# Altium schematic sheet PIC32MK.SchDoc
size A4; SheetNumber: 9; SheetTotal: 13
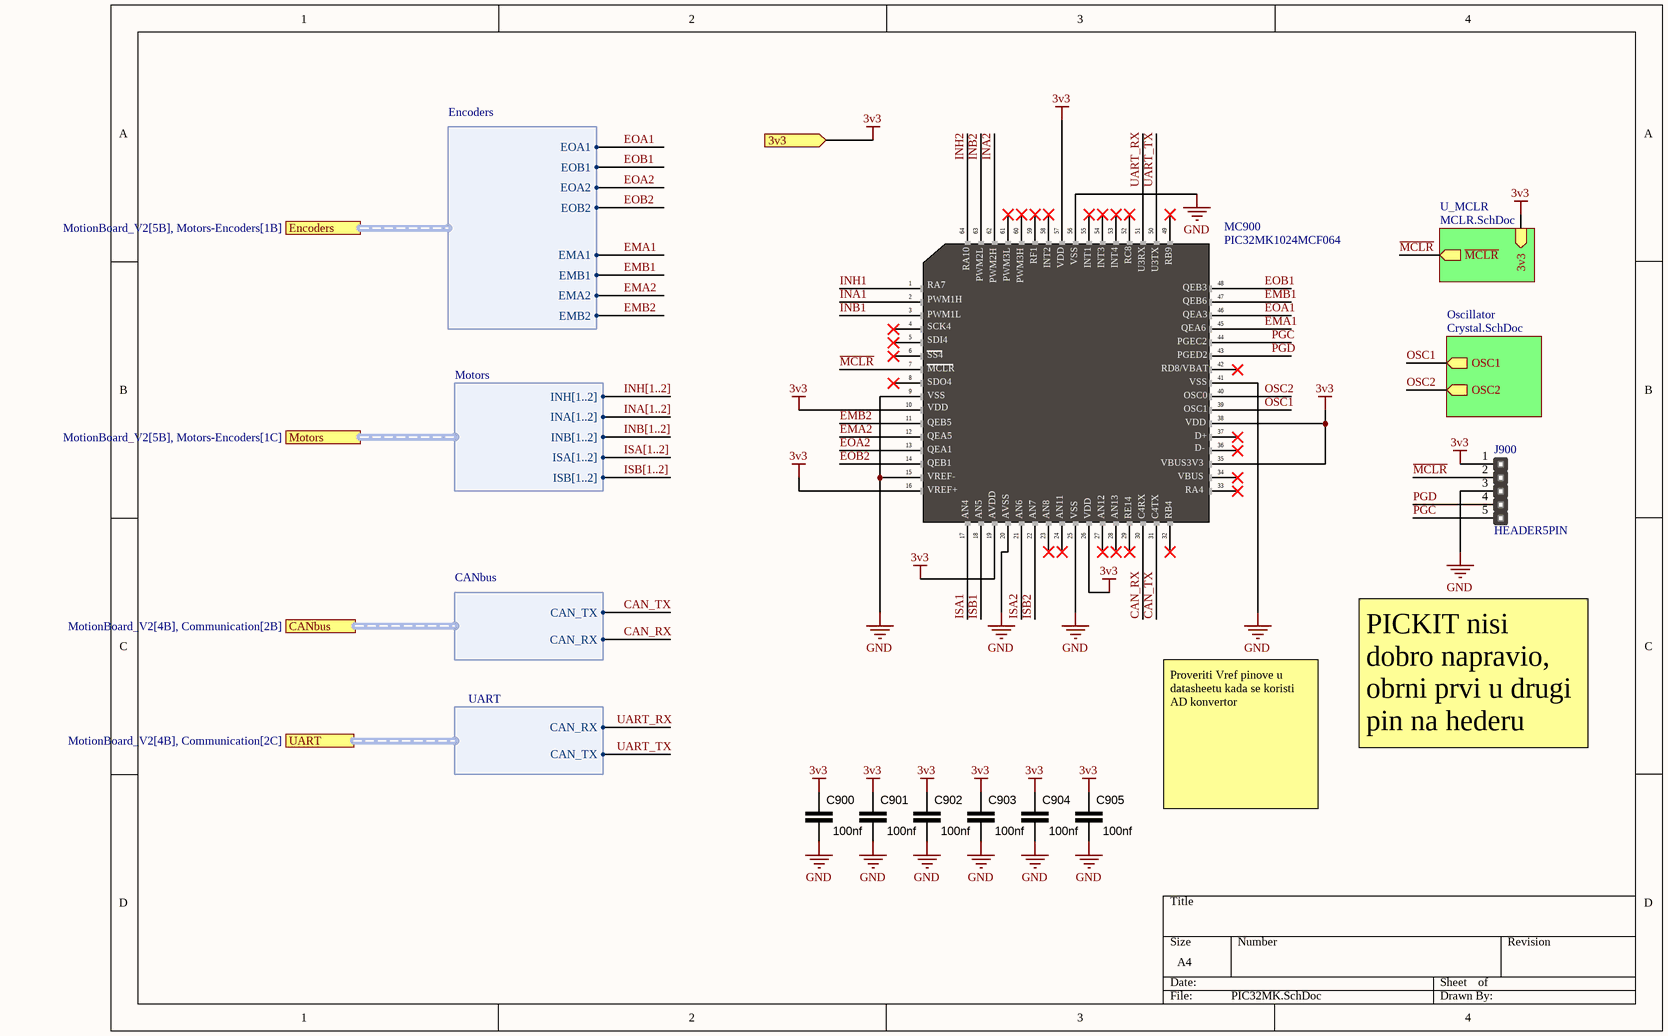
[diagram p0: PIC32MK.SchDoc]

## Parts
C900  100nf  [CAP_0603]
C901  100nf  [CAP_0603]
C902  100nf  [CAP_0603]
C903  100nf  [CAP_0603]
C904  100nf  [CAP_0603]
C905  100nf  [CAP_0603]
J900  HEADER5PIN  [HEADER5PIN]
MC900  PIC32MK1024MCF064  [PIC32MK_64-TQFP]

## Sub-sheets
Oscillator = Crystal.SchDoc: OSC1 (out), OSC2 (out)
U_MCLR = MCLR.SchDoc: ~{MCLR} (out), 3v3 (in)

## Ports
3v3 (in, see MotionBoard_V2[4B], CAN[2A], Communication[3B], LDO[2B], MCLR[3B], Power[2B]), CANbus (harness CANbus, see MotionBoard_V2[4B], Communication[2B]), Encoders (harness Encoders, see MotionBoard_V2[5B], Motors-Encoders[1B]), Motors (harness Motors, see MotionBoard_V2[5B], Motors-Encoders[1C]), UART (harness UART, see MotionBoard_V2[4B], Communication[2C])

## Harnesses
Motors: INH[1..2], INA[1..2], INB[1..2], ISA[1..2], ISB[1..2]
CANbus: CAN_TX, CAN_RX
UART: CAN_RX, CAN_TX
Encoders: EOA1, EOB1, EOA2, EOB2, EMA1, EMB1, EMA2, EMB2

## Nets
3v3: C900.2 C901.2 C902.2 C903.2 C904.2 C905.2 J900.1 MC900.10 MC900.16 MC900.19 MC900.26 MC900.35 MC900.38 MC900.57 ; port 3v3, sheet U_MCLR/3v3
GND: C900.1 C901.1 C902.1 C903.1 C904.1 C905.1 J900.3 MC900.9 MC900.15 MC900.20 MC900.25 MC900.41 MC900.56
~{MCLR}: J900.2 MC900.7 ; sheet U_MCLR/~{MCLR}
CAN_RX: MC900.30 ; port CANbus.CAN_RX
CAN_TX: MC900.31 ; port CANbus.CAN_TX
EMA1: MC900.45 ; port Encoders.EMA1
EMA2: MC900.12 ; port Encoders.EMA2
EMB1: MC900.47 ; port Encoders.EMB1
EMB2: MC900.11 ; port Encoders.EMB2
EOA1: MC900.46 ; port Encoders.EOA1
EOA2: MC900.13 ; port Encoders.EOA2
EOB1: MC900.48 ; port Encoders.EOB1
EOB2: MC900.14 ; port Encoders.EOB2
INA1: MC900.2
INA2: MC900.62
INB1: MC900.3
INB2: MC900.63
INH1: MC900.1
INH2: MC900.64
ISA1: MC900.17
ISA2: MC900.21
ISB1: MC900.18
ISB2: MC900.22
OSC1: MC900.39 ; sheet Oscillator/OSC1
OSC2: MC900.40 ; sheet Oscillator/OSC2
PGC: J900.5 MC900.44
PGD: J900.4 MC900.43
UART_RX: MC900.51 ; port UART.CAN_RX
UART_TX: MC900.50 ; port UART.CAN_TX

Not connected (* = marked no-connect by the designer): MC900 4* 5* 6* 8* 23* 24* 27* 28* 29* 32* 33* 34* 36* 37* 42* 49* 52* 53* 54* 55* 58* 59* 60* 61*

## Buses and harness runs
bus INA[1..2]
bus INB[1..2]
bus INH[1..2]
bus ISA[1..2]
bus ISB[1..2]

## Notes on the sheet
- PICKIT nisi dobro napravio, obrni prvi u drugi pin na hederu
- Proveriti Vref pinove u datasheetu kada se koristi AD konvertor
- (in symbol PIC32MK) RF1; RC8; RA10; INT2; VDD; VSS; INT1; INT3; INT4; RB9; U3RX; U3TX; PWM2L; PWM2H; PWM3L; PWM3H; RA7; QEB3; PWM1H; QEB6; PWM1L; QEA3; SCK4; QEA6; SDI4; PGEC2; SS4; PGED2; MCLR; RD8/VBAT; SDO4; OSC0; OSC1; QEB5; QEA5; D+; QEA1; D-; QEB1; VBUS3V3; VREF-; VBUS; VREF+; RA4; AN4; AN5; AVDD; AVSS; AN6; AN7; AN8; AN11; AN12; AN13; RE14; C4RX; C4TX; RB4

## Library data of the parts
C900-C905 = C000007: CAP CER 100nF 0603 25V X7R; capaticanse: 100nf; ComponentLink1Description: digikey; ComponentLink1URL: https://www.digikey.com/en/products/detail/kyocera-avx/06033C104K4T2A/8019250
J900 = HEADER5PIN: 5 PIN Male Header 2.54mm pitch
MC900 = PIC32MK: PIC32 Motor Control Microcontroller / PIC32MK1024MCF064 / PIC32MK1024MCM064 / Compatible